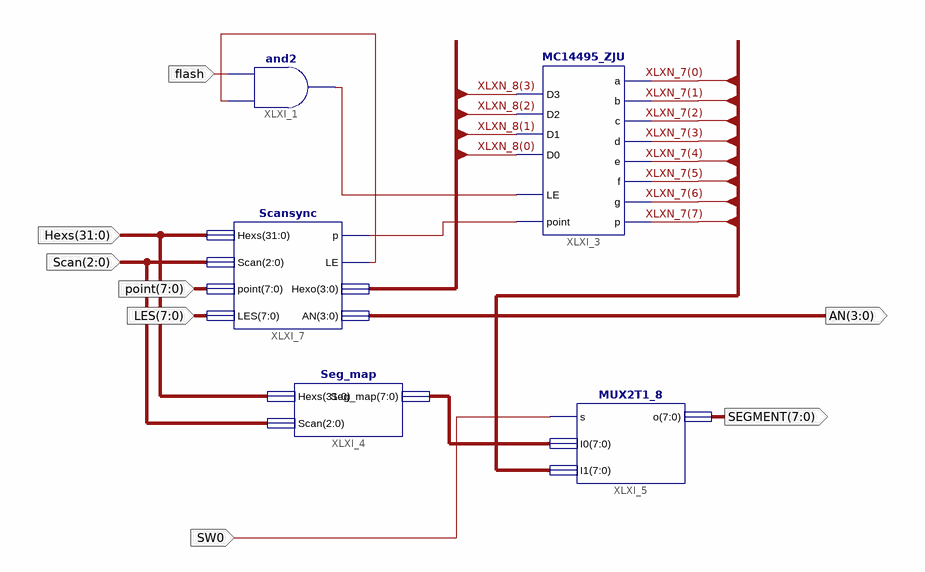
[diagram p0: schematic sheet 1]
// Xilinx ISE schematic Seg7_Dev.sch (kintex7) as structural Verilog: 5 symbols, 8 ports
module Seg7_Dev (
  input  flash,
  input  SW0,
  input  [31:0] Hexs,
  input  [2:0] Scan,
  input  [7:0] point,
  input  [7:0] LES,
  output [3:0] AN,
  output [7:0] SEGMENT
);

  wire XLXN_18, XLXN_21, XLXN_22;
  wire [3:0] XLXN_8;
  wire [7:0] XLXN_6, XLXN_7;

  and XLXI_1 (XLXN_18, XLXN_22, flash);
  MC14495_ZJU XLXI_3 (
    .D0(XLXN_8[0]), .D1(XLXN_8[1]), .D2(XLXN_8[2]), .D3(XLXN_8[3]), .p(XLXN_7[7]), .g(XLXN_7[6]),
    .f(XLXN_7[5]), .e(XLXN_7[4]), .d(XLXN_7[3]), .c(XLXN_7[2]), .b(XLXN_7[1]), .a(XLXN_7[0]),
    .point(XLXN_21), .LE(XLXN_18));
  Seg_map XLXI_4 (.Hexs(Hexs), .Scan(Scan), .Seg_map(XLXN_6));
  MUX2T1_8 XLXI_5 (.s(SW0), .I0(XLXN_6), .I1(XLXN_7), .o(SEGMENT));
  Scansync XLXI_7 (
    .Hexs(Hexs), .Scan(Scan), .point(point), .LES(LES), .p(XLXN_21), .LE(XLXN_22), .Hexo(XLXN_8), .AN(AN));
endmodule
